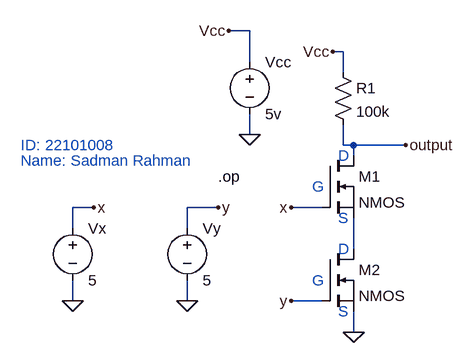
[diagram p0: schematic Task1.asc]
Task1.asc, the LTspice schematic file:
Version 4
SHEET 1 880 680
WIRE 128 64 96 64
WIRE 272 96 256 96
WIRE 128 112 128 64
WIRE 272 128 272 96
WIRE 128 224 128 192
WIRE 272 240 272 208
WIRE 288 240 272 240
WIRE 368 240 288 240
WIRE 288 256 288 240
WIRE -112 336 -144 336
WIRE 80 336 32 336
WIRE 240 336 192 336
WIRE -144 368 -144 336
WIRE 32 368 32 336
WIRE 288 400 288 352
WIRE -144 480 -144 448
WIRE 32 480 32 448
WIRE 240 480 192 480
WIRE 288 528 288 496
FLAG 128 224 0
FLAG 288 528 0
FLAG 96 64 Vcc
FLAG 256 96 Vcc
FLAG 192 336 x
FLAG 192 480 y
FLAG 368 240 output
FLAG -144 480 0
FLAG 32 480 0
FLAG -112 336 x
FLAG 80 336 y
SYMBOL voltage 128 96 R0
WINDOW 123 0 0 Left 0
WINDOW 39 0 0 Left 0
SYMATTR InstName Vcc
SYMATTR Value 5v
SYMBOL res 256 112 R0
SYMATTR InstName R1
SYMATTR Value 100k
SYMBOL nmos 240 256 R0
SYMATTR InstName M1
SYMBOL nmos 240 400 R0
SYMATTR InstName M2
SYMBOL voltage -144 352 R0
SYMATTR InstName Vx
SYMATTR Value 5
SYMBOL voltage 32 352 R0
SYMATTR InstName Vy
SYMATTR Value 5
TEXT 224 304 Left 2 ;G
TEXT 224 448 Left 2 ;G
TEXT 264 256 Left 2 ;D
TEXT 264 400 Left 2 ;D
TEXT 264 352 Left 2 ;S
TEXT 264 496 Left 2 ;S
TEXT 80 288 Left 2 !.op
TEXT -224 240 Left 2 ;ID: 22101008
TEXT -224 264 Left 2 ;Name: Sadman Rahman

The netlist it stands for:
* Task1.asc
Vcc Vcc 0 5v
R1 Vcc output 100k
M1 output x N001 N001 NMOS
M2 N001 y 0 0 NMOS
Vx x 0 5
Vy y 0 5
.model NMOS NMOS
.model PMOS PMOS
.lib standard.mos
* G
* G
* D
* D
* S
* S
.op
* ID: 22101008
* Name: Sadman Rahman
.backanno
.end